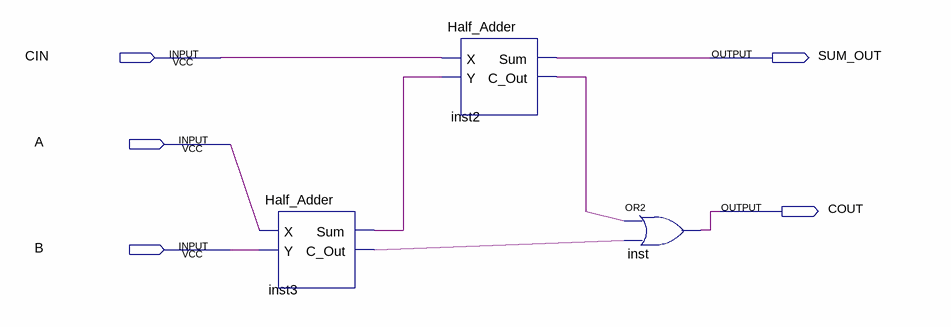
[diagram p0: schematic sheet]
// Quartus schematic Full_Adder.bdf as structural Verilog: 3 symbols, 5 pins
module Full_Adder (
  input  CIN,
  input  A,
  input  B,
  output SUM_OUT,
  output COUT
);

  wire inst2_c_out, inst3_c_out, inst3_sum;

  Half_Adder inst3 (.X(A), .Y(B), .Sum(inst3_sum), .C_Out(inst3_c_out));
  Half_Adder inst2 (.X(CIN), .Y(inst3_sum), .Sum(SUM_OUT), .C_Out(inst2_c_out));
  or inst (COUT, inst2_c_out, inst3_c_out);
endmodule
